# EAGLE design EnsembleFive (EAGLE 7.6.0)
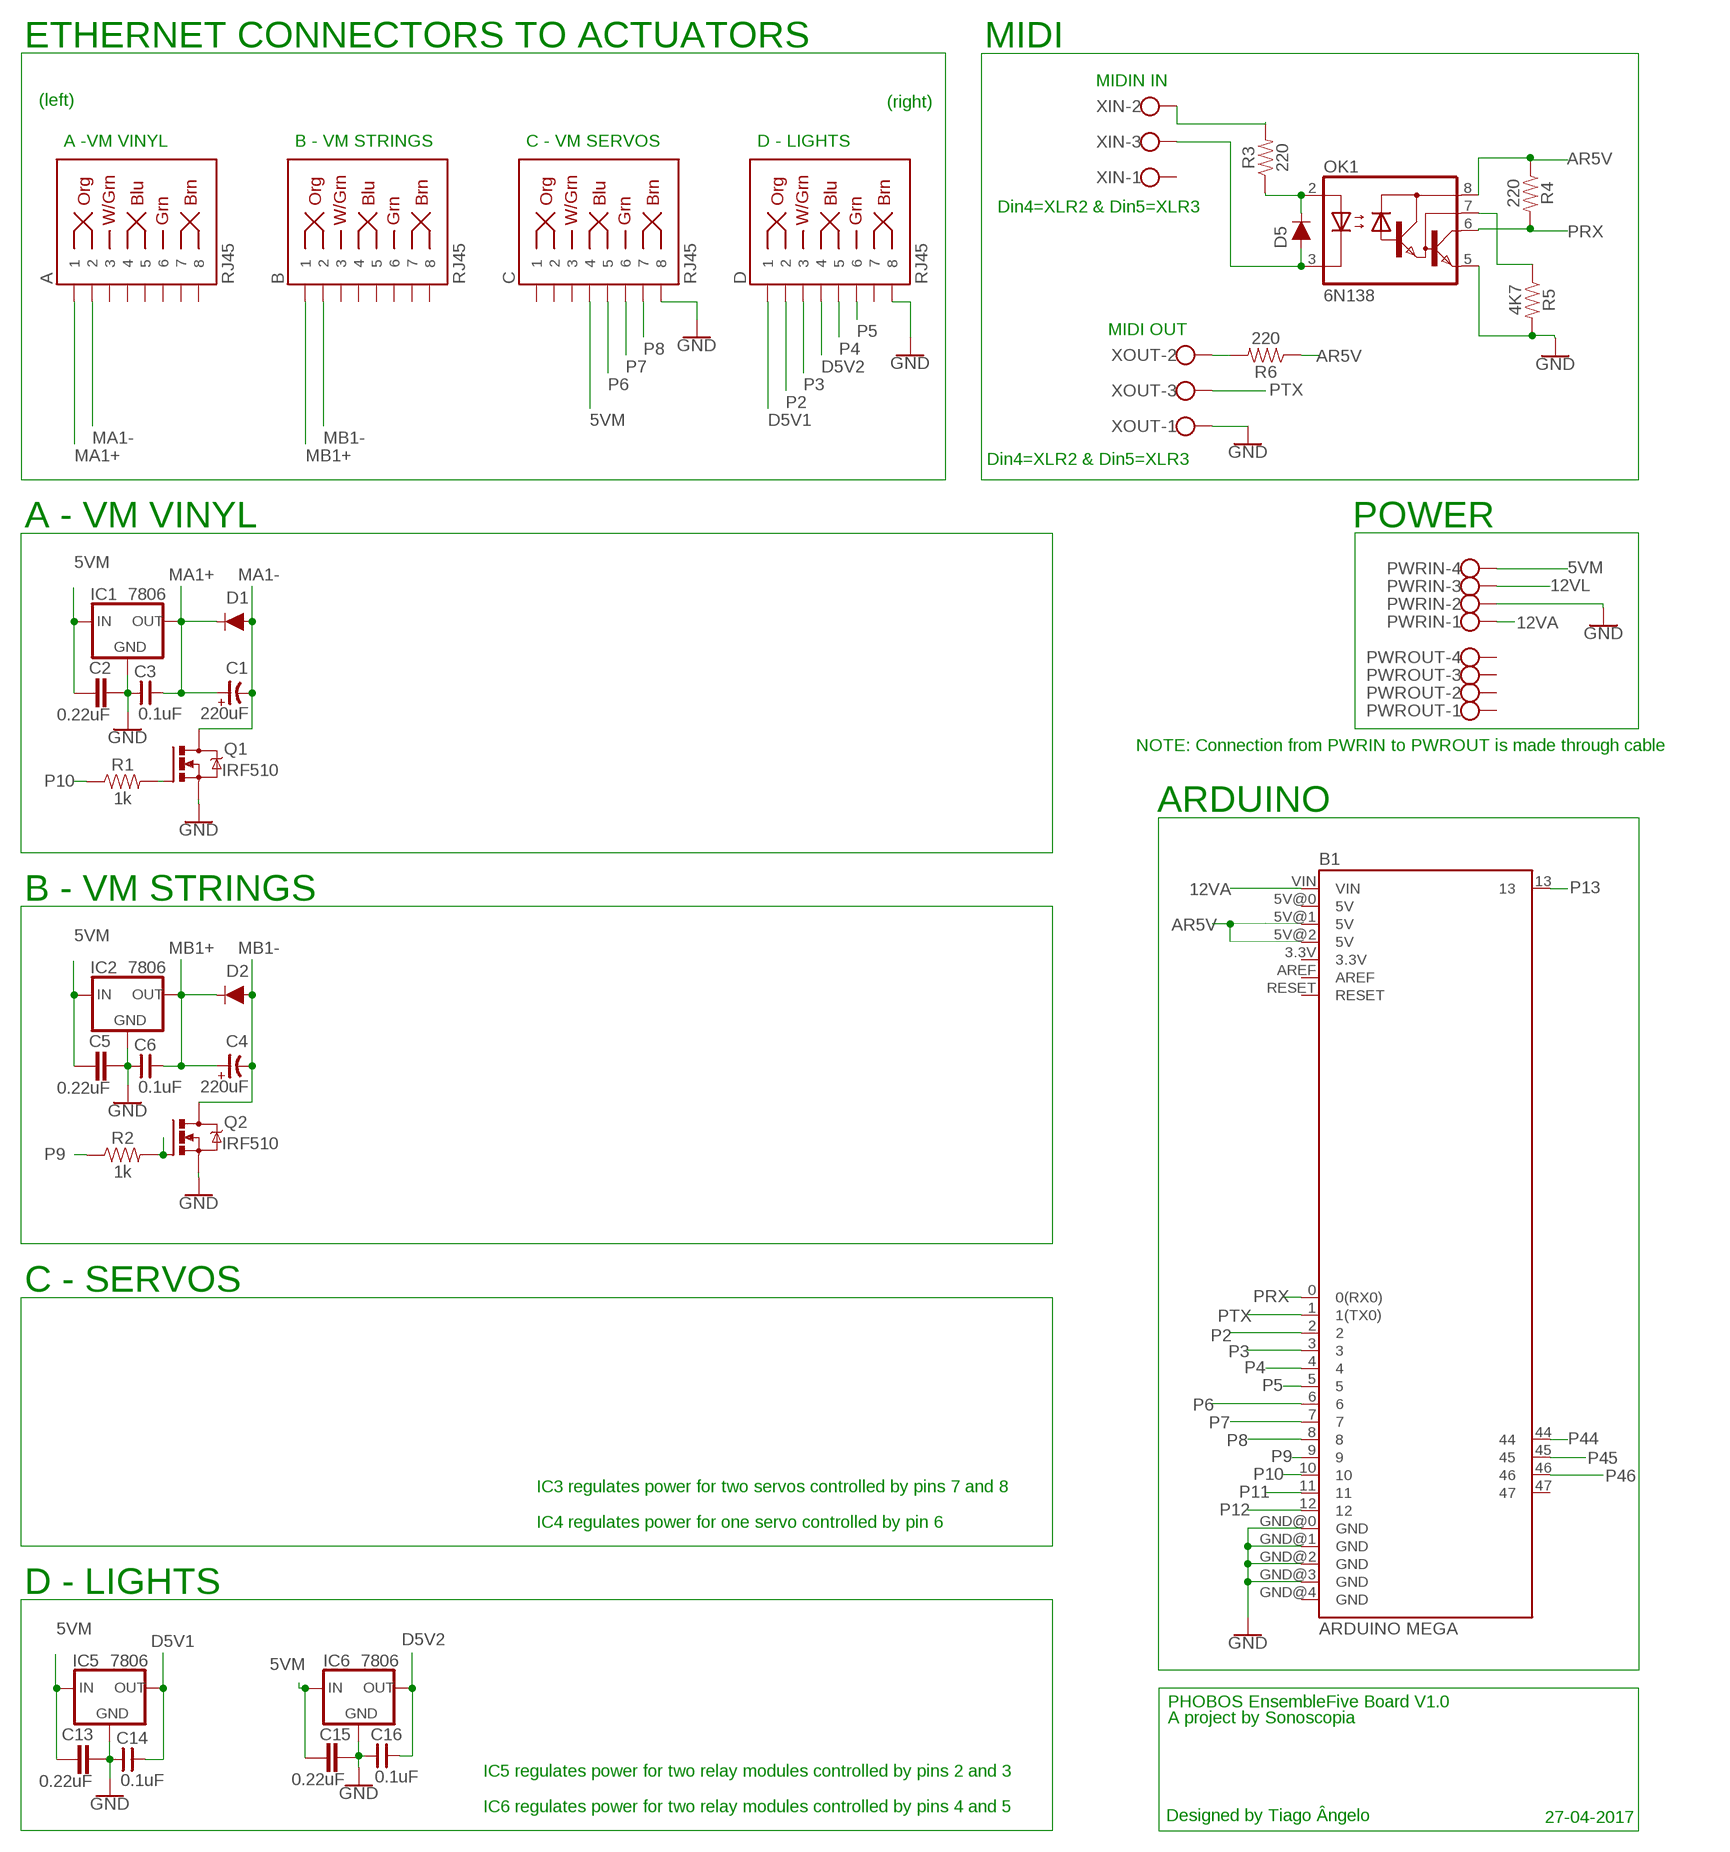
[diagram p0: schematic, sheet 1]

## Parts
A  RJ45  RJ45-8  [RJ45-8]
B  RJ45  RJ45-8  [RJ45-8]
B1  ARDUINO MEGA  ARDUINO_MEGA_R3FULL  [ARDUINO_MEGA]
C  RJ45  RJ45-8  [RJ45-8]
C1  220uF  CP-E-035X080  [E-035X080]
C2  0.22uF  C5/3  [C5B3]
C3  0.1uF  CNP-C025-050X025  [C025-050X025]
C4  220uF  CP-E-035X080  [E-035X080]
C5  0.22uF  C5/3  [C5B3]
C6  0.1uF  CNP-C025-050X025  [C025-050X025]
C13  0.22uF  C5/3  [C5B3]
C14  0.1uF  CNP-C025-050X025  [C025-050X025]
C15  0.22uF  C5/3  [C5B3]
C16  0.1uF  CNP-C025-050X025  [C025-050X025]
D  RJ45  RJ45-8  [RJ45-8]
D1  1A/50V/1.1V  DIODE-KIT2  [DIODE-1N4001-KIT]
D2  1A/50V/1.1V  DIODE-KIT2  [DIODE-1N4001-KIT]
D5  200mA/100V/1V  DIODE-1N4148  [DIODE-1N4148]
IC1  7806  78XXS  [78XXS]
IC2  7806  78XXS  [78XXS]
IC5  7806  78XXS  [78XXS]
IC6  7806  78XXS  [78XXS]
OK1  6N138  [DIL08]
PWRIN  W237-4  [W237-4]
PWROUT  W237-4  [W237-4]
Q1  IRF510  IRF520  [TO220BV]
Q2  IRF510  IRF520  [TO220BV]
R1  1k  1KOHM-VERT-1/4W-1%  [AXIAL-0.1]
R2  1k  1KOHM-VERT-1/4W-1%  [AXIAL-0.1]
R3  220  1KOHM-HORIZ-1/4W-5%  [AXIAL-0.3]
R4  220  1KOHM-HORIZ-1/4W-5%  [AXIAL-0.3]
R5  4K7  1KOHM-HORIZ-1/4W-5%  [AXIAL-0.3]
R6  220  1KOHM-HORIZ-1/4W-5%  [AXIAL-0.3]
XIN  W237-103  [W237-103]
XOUT  W237-103  [W237-103]

## Nets
5VM [5VM]: C2.1 C5.1 C13.1 C15.1 C.4 IC1.IN IC2.IN IC5.IN IC6.IN PWRIN.4
12VA [12VA]: B1.VIN PWRIN.1
12VL [12VL]: PWRIN.3
AR5V: B1.5V@1(5V) B1.5V@2(5V) OK1.8(VCC) R4.P$1 R6.P$1
D5V1: C14.2 D.1 IC5.OUT
D5V2: C16.2 D.4 IC6.OUT
GND [GND]: B1.GND@0(GND) B1.GND@1(GND) B1.GND@2(GND) B1.GND@3(GND) C2.2 C3.1 C5.2 C6.1 C13.2 C14.1 C15.2 C16.1 C.8 D.8 IC1.GND IC2.GND IC5.GND IC6.GND OK1.5(GND) PWRIN.2 Q1.S Q2.S R5.P$2 XOUT.1
MA1+: A.1 C1.+ C3.2 D1.C IC1.OUT
MA1-: A.2 C1.- D1.A Q1.D
MB1+: B.1 C4.+ C6.2 D2.C IC2.OUT
MB1-: B.2 C4.- D2.A Q2.D
N$1: Q1.G R1.P$2
N$2: R6.P$2 XOUT.2
N$20: Q2.G R2.P$2
N$25: D5.A OK1.3(C) XIN.3
N$26: D5.C OK1.2(A) R3.P$1
N$27: R3.P$2 XIN.2
N$29: OK1.7(VB) R5.P$1
P2: B1.2 D.2
P3: B1.3 D.3
P4: B1.4 D.5
P5: B1.5 D.6
P6: B1.6 C.5
P7: B1.7 C.6
P8: B1.8 C.7
P9: B1.9 R2.P$1
P10: B1.10 R1.P$1
P11: B1.11
P12: B1.12
P13: B1.13
P44: B1.44
P45: B1.45
P46: B1.46
PRX: B1.0(0(RX0)) OK1.6(VO) R4.P$2
PTX: B1.1(1(TX0)) XOUT.3
Unconnected: A.3 A.4 A.5 A.6 A.7 A.8 B1.3.3V B1.5V@0(5V) B1.47 B1.AREF B1.GND@4(GND) B1.RESET B.3 B.4 B.5 B.6 B.7 B.8 C.1 C.2 C.3 D.7 PWROUT.1 PWROUT.2 PWROUT.3 PWROUT.4 XIN.1

## Notes on the sheet
- ETHERNET CONNECTORS TO ACTUATORS | MIDI
- MIDIN IN
- (left) | (right)
- A -VM VINYL | B - VM STRINGS | C - VM SERVOS | D - LIGHTS
- Din4=XLR2 & Din5=XLR3
- MIDI OUT
- Din4=XLR2 & Din5=XLR3
- A - VM VINYL | POWER
- NOTE: Connection from PWRIN to PWROUT is made through cable
- ARDUINO
- B - VM STRINGS
- C - SERVOS
- IC3 regulates power for two servos controlled by pins 7 and 8
- IC4 regulates power for one servo controlled by pin 6
- D - LIGHTS
- PHOBOS EnsembleFive Board V1.0
- A project by Sonoscopia
- IC5 regulates power for two relay modules controlled by pins 2 and 3
- IC6 regulates power for two relay modules controlled by pins 4 and 5
- Designed by Tiago Ângelo | 27-04-2017

## Library data of the parts
A B C D = SparkFun-Connectors:RJ45-8: RJ45 Jack - 8 pin Simple RJ45, 8-pin connection. Commonly used for Cat5, Cat5e, and Cat6 Ethernet cables. Here is the connector we sell at SparkFun: RJ45 8-Pin Connector <https://www.sparkfun.com/products/643> (PRT-00643) Datasheet <https://cdn.sparkfun.com/datasheets/Prototyping/04908.pdf> It is used on this SparkFun product: SparkFun RJ45 Breakout <https://www.sparkfun.com/products/716> (BOB-00716) Note, you may also be interested in the "MAGJACK" version of this. It is basically a RJ45 connector, but also has some status LEDs built into the connector housing. You can check that out in this library at the device named "MAGJACK.dev" and see these products online: RJ45 Ethernet MagJack-Compatible <https://www.sparkfun.com/products/8534> (PRT-08534) SparkFun RJ45 MagJack Breakout <https://www.sparkfun.com/products/13021> (BOB-13021); PROD_ID: CONN-08506; SF_ID: PRT-00643
B1 = PHOBOS-Boards:ARDUINO_MEGA_R3: Arduino Mega R3 ATmega2560 R3 compatible footprint. SparkFun Products: Arduino Mega 2560 R3 <https://www.sparkfun.com/products/11061>
C1 C4 = cap-master:CP-: POLARIZED CAP
C2 C5 C13 C15 = capacitor-wima:C: CAPACITOR naming: grid - package width
C3 C6 C14 C16 = cap-master:CNP-: NON-POLARIZED CAP
D1 D2 = SparkFun-DiscreteSemi:DIODE: Diode These are standard reverse protection diodes and small signal diodes. SparkFun Products: SparkFun SparkPunk Sound Kit <https://www.sparkfun.com/products/11177> SparkFun ESP8266 Thing <https://www.sparkfun.com/products/13231>; PROD_ID: DIO-09176
D5 = SparkFun-DiscreteSemi:DIODE: Diode These are standard reverse protection diodes and small signal diodes. SparkFun Products: SparkFun SparkPunk Sound Kit <https://www.sparkfun.com/products/11177> SparkFun ESP8266 Thing <https://www.sparkfun.com/products/13231>; PROD_ID: DIO-08378
IC1 IC2 IC5 IC6 = v-reg:78XXS: VOLTAGE REGULATOR
OK1 = optocoupler:6N138: MOTOROLA OPTO COUPLER; MF: VISHAY/TELEFUNKEN; MPN: 6N138; OC_FARNELL: 9860150; OC_NEWARK: 35K5294
PWRIN PWROUT = con-wago-500:W237-4: WAGO SCREW CLAMP; OC_FARNELL: unknown; OC_NEWARK: unknown
Q1 Q2 = transistor-power:IRF520: HEXFET Power MOSFET
R1 R2 = SparkFun-Resistors:1KOHM: 1kΩ resistor A resistor is a passive two-terminal electrical component that implements electrical resistance as a circuit element. Resistors act to reduce current flow, and, at the same time, act to lower voltage levels within circuits. - Wikipedia; PROD_ID: RES-12182
R3-R6 = SparkFun-Resistors:1KOHM: 1kΩ resistor A resistor is a passive two-terminal electrical component that implements electrical resistance as a circuit element. Resistors act to reduce current flow, and, at the same time, act to lower voltage levels within circuits. - Wikipedia; PROD_ID: RES-08380; VALUE: 1k
XIN XOUT = con-wago-500:W237-103: WAGO SCREW CLAMP; MPN: 237-103; OC_FARNELL: unknown; OC_NEWARK: 18M7116

## Net classes
0 default: width 0.508 mm, drill 0.508 mm, clearance 0.406 mm
1 GND: width 1.016 mm, drill 0.508 mm, clearance 0.508 mm
2 5VM: width 1.016 mm, drill 0.508 mm, clearance 0.508 mm
3 12VL: width 0.61 mm, drill 0.508 mm, clearance 0.508 mm
4 12VA: width 0.508 mm, drill 0.508 mm, clearance 0.508 mm
5 AR5V: width 0.406 mm, drill 0.508 mm, clearance 0.508 mm
6 PTX: width 0.406 mm, drill 0.508 mm, clearance 0.508 mm
7 PRX: width 0.406 mm, drill 0.508 mm, clearance 0.508 mm

## Board
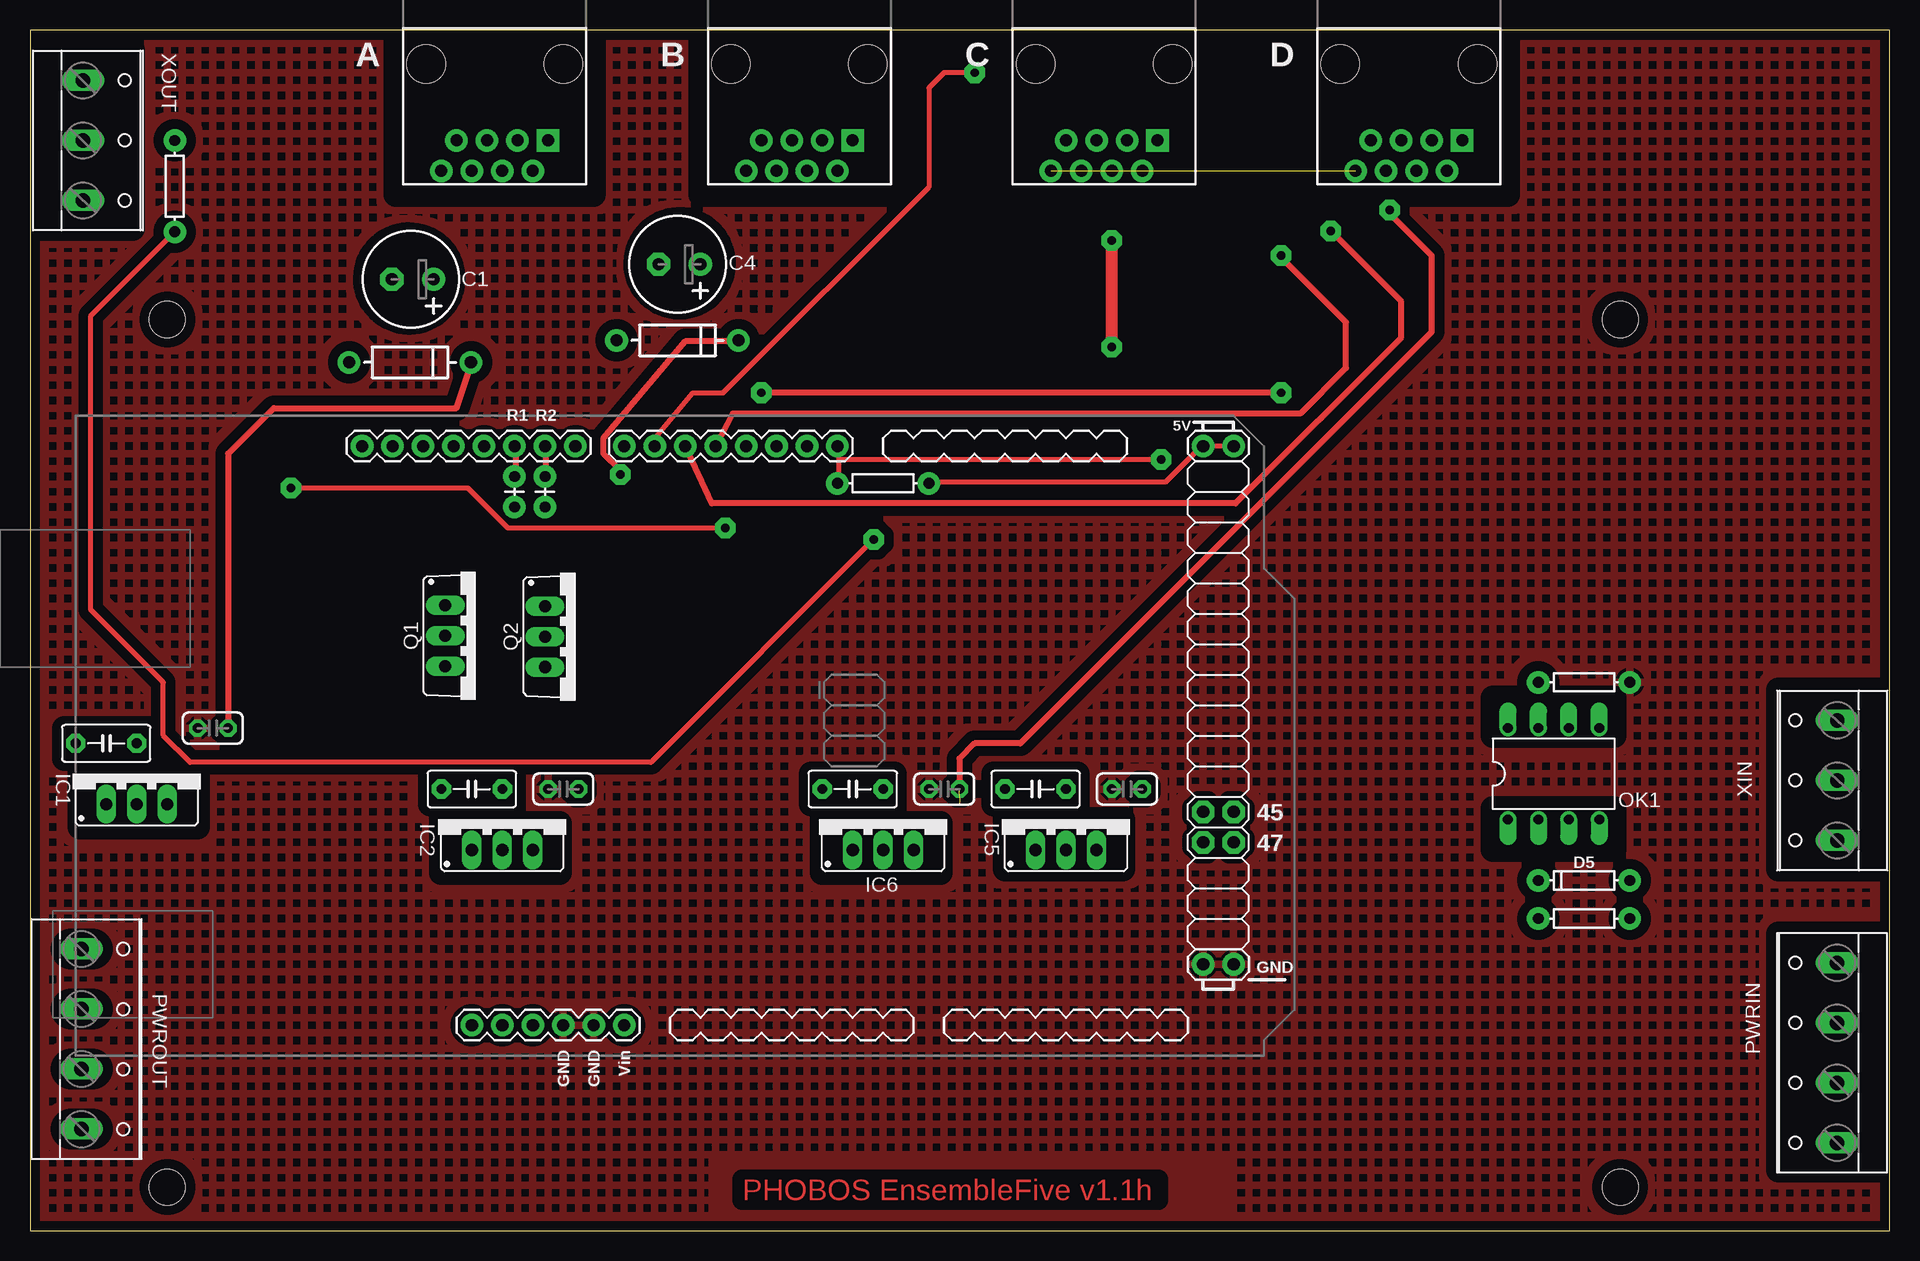
[diagram p1: board, top side]
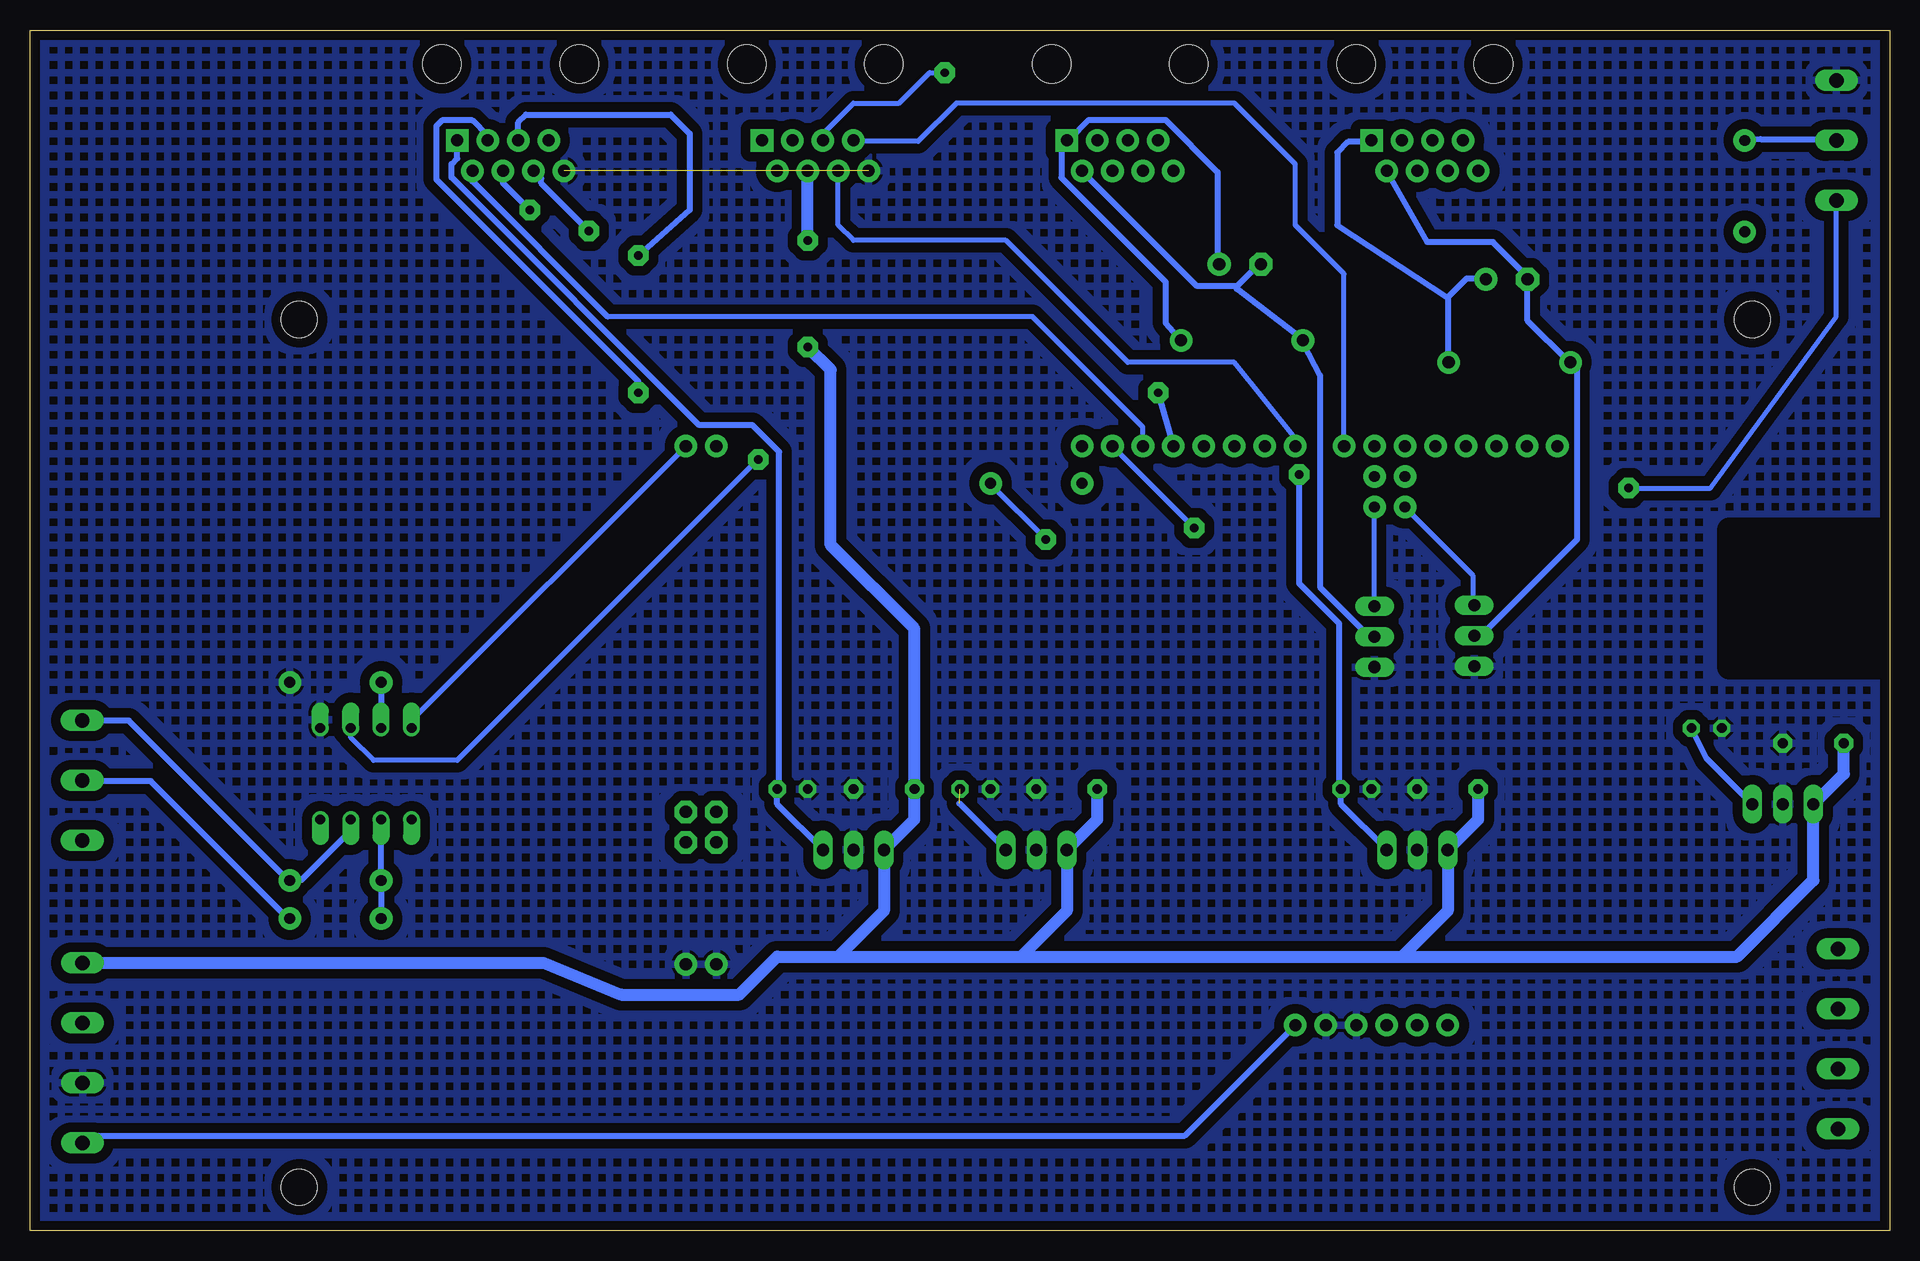
[diagram p2: board, bottom side, seen from below]

Size 155 x 100.08 mm. Coordinates in mm from the lower left corner, seen from the top.
Outline: 0,0 155,0 155,100.08 0,100.08 0,0
Copper layers (1*16): Top 0.035mm / dielectric 1.5mm / Bottom 0.035mm
Design rules "Dek": minimum track width 12mil, minimum drill 36mil, track to track 12mil, track to pad 12mil, pad to pad 12mil, via to via 12mil, smd to smd 0mil, copper to edge 10mil, drill to drill 12mil, minimum pad ring 12mil, minimum via ring 20mil, stop-mask expansion 4mil, vias tented up to drill 25mil, thermal gap 10mil
Holes 3 mm at 132.55,75.95 132.55,3.65 11.45,3.65 11.45,75.95
tRestrict: area 30.5,86.4 to 47,108; area 55.9,86.4 to 72.4,108; area 81.3,86.4 to 97.8,108; area 106.7,86.4 to 123.2,108; area 121.9,41.3 to 132.1,44.5; area 121.9,31.8 to 132.1,35.2; area 145.7,5.1 to 154.6,24.8; area 145.7,30.2 to 154.9,45.1; area -0.3,83.5 to 8.6,98.4; area 4.1,33.7 to 14,37.8; area 34.3,29.8 to 44.1,34; area 66,29.8 to 75.9,34; 9 more areas
bRestrict: area -2.5,47 to 13.3,58.4
vRestrict: area 71.1,64.1 to 91.4,66.7; area 96.5,36.2 to 101.6,64.1; area 96.5,23.5 to 101.6,31.1; area 53.3,15.9 to 73.7,18.4; area 76.2,15.9 to 96.5,18.4; area -2.5,47 to 13.3,58.4; area 121.9,35.6 to 132.1,40.6; area 94.6,72.1 to 101,74.9; area 76.8,72.1 to 83.2,74.9; area 52.1,74 to 58.4,76.8; area 28.6,73.7 to 34.9,76.5

### Footprints (pad centres in the part's own frame; a part is rotated, then mirrored left to right if it is on the bottom)
RJ45-8 = drill 1 pad 1.88 square: 1 -4.445,6.35 | drill 1 pad 1.88: 2 -3.175,8.89; 3 -1.905,6.35; 4 -0.635,8.89; 5 0.635,6.35; 6 1.905,8.89; 7 3.175,6.35; 8 4.445,8.89 | hole 3.2: -5.715,0; 5.715,0
ARDUINO_MEGA = drill 1.016 pad 1.88: 0 13.97,24.13; 1 11.43,24.13; 2 8.89,24.13; 3 6.35,24.13; 3.3V -13.97,-24.13; 4 3.81,24.13; 5 1.27,24.13; 5V@0 -11.43,-24.13; 5V@1 44.45,24.13; 5V@2 46.99,24.13; 6 -1.27,24.13; 7 -3.81,24.13; 8 -7.874,24.13; 9 -10.414,24.13; 10 -12.954,24.13; 11 -15.494,24.13; 12 -18.034,24.13; 13 -20.574,24.13; AREF -25.654,24.13; GND@0 -8.89,-24.13; GND@1 -6.35,-24.13; GND@2 44.45,-19.05; GND@3 46.99,-19.05; GND@4 -23.114,24.13; RESET -16.51,-24.13; VIN -3.81,-24.13 | drill 1.016 pad 1.88 octagon: 44 44.45,-6.35; 45 46.99,-6.35; 46 44.45,-8.89; 47 46.99,-8.89
E-035X080 = drill 1.016 pad 1.93: + -1.905,0 | drill 1.016 pad 1.93 octagon: - 1.587,0
C5B3 = drill 0.813 pad 1.6 octagon: 1 -2.54,0; 2 2.54,0
C025-050X025 = drill 0.813 pad 1.422 octagon: 1 -1.27,0; 2 1.27,0
DIODE-1N4001-KIT = drill 1.016 pad 1.88: A -5.08,0; C 5.08,0
DIODE-1N4148 = drill 0.9 pad 1.88: A -3.81,0; C 3.81,0
78XXS = drill 1.016 long: GND 0,-2.54; IN -2.54,-2.54; OUT 2.54,-2.54
DIL08 = drill 0.813 offset: 1 -3.81,-3.81; 2 -1.27,-3.81; 3 1.27,-3.81; 4 3.81,-3.81; 5 3.81,3.81; 6 1.27,3.81; 7 -1.27,3.81; 8 -3.81,3.81
W237-4 = drill 1.194 long: 1 -7.5,-1.27; 2 -2.5,-1.27; 3 2.5,-1.27; 4 7.5,-1.27
TO220BV = drill 1.016 long: D 0,-2.54; G -2.54,-2.54; S 2.54,-2.54
AXIAL-0.1 = drill 0.9 pad 1.88: P$1 -1.27,0; P$2 1.27,0
AXIAL-0.3 = drill 0.9 pad 1.88: P$1 -3.81,0; P$2 3.81,0
W237-103 = drill 1.194 long: 1 -5,-1.29; 2 0,-1.29; 3 5,-1.29

### Placement (x,y rotation side)
A  38.73,97.23 180 top
B  64.13,97.23 180 top
B1  53.34,41.27 0 top
C  89.53,97.23 180 top
C1  31.75,79.3 180 top
C2  6.35,40.64 0 top
C3  15.24,41.91 0 top
C4  53.98,80.57 180 top
C5  36.83,36.83 0 top
C6  44.45,36.83 0 top
C13  83.82,36.83 0 top
C14  91.44,36.83 0 top
C15  68.58,36.83 0 top
C16  76.2,36.83 0 top
D  114.94,97.23 180 top
D1  31.67,72.39 0 top
D2  53.98,74.22 0 top
D5  129.54,29.21 180 top
IC1  8.89,38.1 0 top
IC2  39.37,34.29 0 top
IC5  86.36,34.29 0 top
IC6  71.12,34.29 0 top
OK1  127,38.1 0 top
PWRIN  149.35,14.84 90 top
PWROUT  5.57,16 270 top
Q1  37.15,49.6 270 top
Q2  45.47,49.53 270 top
R1  40.39,61.59 270 top
R2  42.93,61.59 270 top
R3  129.54,26.04 0 top
R4  71.12,62.3 180 top
R5  129.54,45.72 0 top
R6  12.06,87.07 90 top
XIN  149.35,37.54 90 top
XOUT  5.71,90.88 270 top

### Tracks (layer width: path | path; a pad name or v marks a point on that pad's centre or on a via)
5VM  (via drill 0.7)
  Top 1.016: v90.17,73.66 v90.17,82.55
  Bottom 1.016: PWRIN.4 112.19,22.34 105.73,19.68 95.88,19.68 92.71,22.86 87.63,22.86 | C15.1 66.04,34.29 IC6.IN 68.58,26.67 72.39,22.86 | C5.1 34.29,34.29 IC2.IN 36.83,26.67 40.64,22.86 | C2.1 3.81,38.1 IC1.IN 6.35,29.21 12.7,22.86 40.64,22.86 | 87.63,22.86 72.39,22.86 | 72.39,22.86 40.64,22.86 | 87.63,22.86 83.82,26.67 IC5.IN 81.28,34.29 C13.1 81.28,50.16 88.26,57.15 88.26,71.75 v90.17,73.66 | v90.17,82.55 C.4
12VA
  Bottom 0.508: 150.42,7.54 PWRIN.1 150.14,7.34 149.54,7.94 58.74,7.94 B1.VIN 49.61,17.14
AR5V  (via drill 0.7)
  Top 0.406: R4.P$1 74.98,62.41 94.64,62.41 97.64,65.41 B1.5V@1 B1.5V@2 | v70.33,57.63 51.75,39.05 13.34,39.05 11.11,41.27 11.11,45.72 5.08,51.75 5.08,76.28 R6.P$1
  Bottom 0.406: OK1.8 123.19,42.55 B1.5V@2 | v70.33,57.63 74.93,62.23 R4.P$1
D5V1
  Bottom 0.508: IC5.OUT 92.71,35.56 C14.2 92.55,36.99 92.55,64.93 94.77,67.15 99.22,67.15 119.86,87.79 119.86,88.9 119.38,89.38 D.1
D5V2  (via drill 0.7)  (1 unrouted)
  Top 0.508: C16.2 77.47,39.37 78.74,40.64 82.55,40.64 116.84,74.93 116.84,81.28 113.35,84.77 v113.35,85.09
  Bottom 0.508: IC6.OUT 77.54,35.63 | D.4 115.57,87.31 v113.35,85.09
GND  (1 unrouted)
  pour Bottom (isolate 0.813, hatched): -5.08,104.14 160.02,104.14 160.02,0 -5.08,0
  pour Top (isolate 0.813, hatched): 0,100.33 154.94,100.33 154.94,0 0,0
MA1+
  Top 0.508: C3.2 16.51,64.77 20.32,68.58 35.56,68.58 36.83,72.31 D1.C
  Bottom 0.508: A.1 43.2,90.75 45.14,90.75 46.04,89.85 46.04,83.82 36.83,77.79 36.76,77.86 | D1.C 36.76,77.86 | 36.76,77.86 35.24,79.38 33.73,79.38 C1.+ | IC1.OUT 15.24,39.37 C3.2
MA1-
  Bottom 0.508: A.2 41.83,88.24 38.53,82.4 33.05,82.4 30.17,79.53 C1.- 30.17,79.07 30.17,75.87 26.75,72.44 D1.A 26.52,72.21 26.06,71.75 26.06,57.61 34.06,49.61 34.52,49.61 Q1.D
MB1+  (via drill 0.7)
  Top 0.508: v49.21,63.02 49.21,63.34 47.78,64.77 47.78,66.04 54.61,74.14 59.05,74.14 D2.C
  Bottom 0.508: D2.C 60.35,75.67 60.35,79.1 69.04,87.78 69.04,90.3 68.58,90.75 B.1 68.35,90.98 66.75,92.58 60.35,92.58 56.01,88.24 56.01,80.8 C4.+ | IC2.OUT 45.72,35.56 C6.2 45.88,36.99 45.88,50.64 49.21,53.98 v49.21,63.02
MB1-
  Bottom 0.508: 54.41,78.74 57.71,78.74 67.21,88.24 B.2 | 54.41,78.74 52.58,80.57 C4.- | 54.41,78.74 54.41,78.51 49.02,74.4 D2.A 48.9,73.98 47.47,71.28 47.47,53.66 43.34,49.53 Q2.D
N$1
  Bottom 0.406: 34.75,52.35 34.75,54.63 40.23,60.12
  Bottom 0.508: 34.75,52.35 Q1.G | 40.23,60.12 R1.P$2
N$2
  Bottom 0.508: XOUT.2 3.89,90.98 10.74,90.98 R6.P$2
N$3
  pour Top (isolate 0.813): 56.83,6.35 100.01,6.35 100.01,0 56.83,0
N$20
  Bottom 0.406: 42.98,52.12 42.98,60.12 R2.P$2
  Bottom 0.508: 42.98,52.12 Q2.G
N$25
  Bottom 0.508: OK1.3 128.47,34.29 128.47,33.15 132.36,29.26 133.27,29.26 D5.A 133.5,29.26 146.76,42.52 150.42,42.52 XIN.3
N$26
  Bottom 0.508: OK1.2 D5.C R3.P$1
N$27
  Bottom 0.508: XIN.2 150.42,37.49 144.93,37.49 133.5,26.06 R3.P$2
N$29
  Bottom 0.508: R5.P$1 OK1.7
P2
  Bottom 0.406: B1.2 62.23,66.99 71.44,76.2 106.84,76.2
  Bottom 0.508: 106.84,76.2 118.11,87.47 D.2
P3  (via drill 0.7)
  Top 0.508: v104.3,69.85 v60.96,69.85
  Bottom 0.508: v60.96,69.85 B1.3 | v104.3,69.85 104.3,70.8 121.13,87.63 121.13,92.08 120.65,92.55 118.11,92.55 116.84,91.28 D.3
P4  (via drill 0.7)
  Top 0.508: B1.4 58.58,68.1 105.89,68.1 109.7,71.91 109.7,75.72 104.3,81.12 v104.3,81.28
  Bottom 0.508: D.5 114.3,92.39 113.67,93.03 101.6,93.03 100.01,91.44 100.01,85.09 v104.3,81.28
P5  (via drill 0.7)
  Top 0.508: B1.5 56.83,60.64 100.49,60.64 114.3,74.45 114.3,77.47 v108.43,83.34
  Bottom 0.508: 113.03,88.27 D.6 112.4,87.7 112.4,87.31 v108.43,83.34
P6  (via drill 0.7)
  Top 0.406: v78.74,96.52 76.2,96.52 74.93,95.25 74.93,87 57.79,69.85 55.24,69.85 52.07,66.04 B1.6
  Bottom 0.406: C.5 88.9,91.44 86.36,93.98 82.55,93.98 80.01,96.52 v78.74,96.52
P7
  Bottom 0.406: B1.7 49.53,66.04 54.61,72.39 63.5,72.39 73.66,82.55 86.36,82.55 87.63,83.82 C.6
P8
  Bottom 0.406: B1.8 45.47,79.76 49.53,83.82 49.53,88.9 54.61,93.98 77.79,93.98 80.96,90.81 86.28,90.81 C.7
P9
  Top 0.508: R2.P$1 42.98,62.87 42.98,65.38 B1.9
P10
  Top 0.508: R1.P$1 40.46,62.87 40.46,65.38 B1.10
PRX  (via drill 0.7)
  Top 0.406: 67.44,64.29 67.44,62.41 R4.P$2 | B1.0 67.44,65.38 67.44,64.29 | 67.44,64.29 v94.3,64.29
  Bottom 0.406: v94.3,64.29 119.38,39.21 126.37,39.21 128.27,41.12 OK1.6
PTX  (via drill 0.7)
  Top 0.406: v21.75,61.91 36.51,61.91 39.85,58.58 v57.94,58.58
  Bottom 0.406: v21.75,61.91 14.92,61.91 4.45,76.2 4.45,85.72 XOUT.3 | B1.1 v57.94,58.58

### Text on the board
Top: PHOBOS EnsembleFive v1.1h
tSilk: VINYL | SERVOS | STRINGS | LIGHTS